# Altium schematic sheet TankBoardSheet1.SchDoc
size A
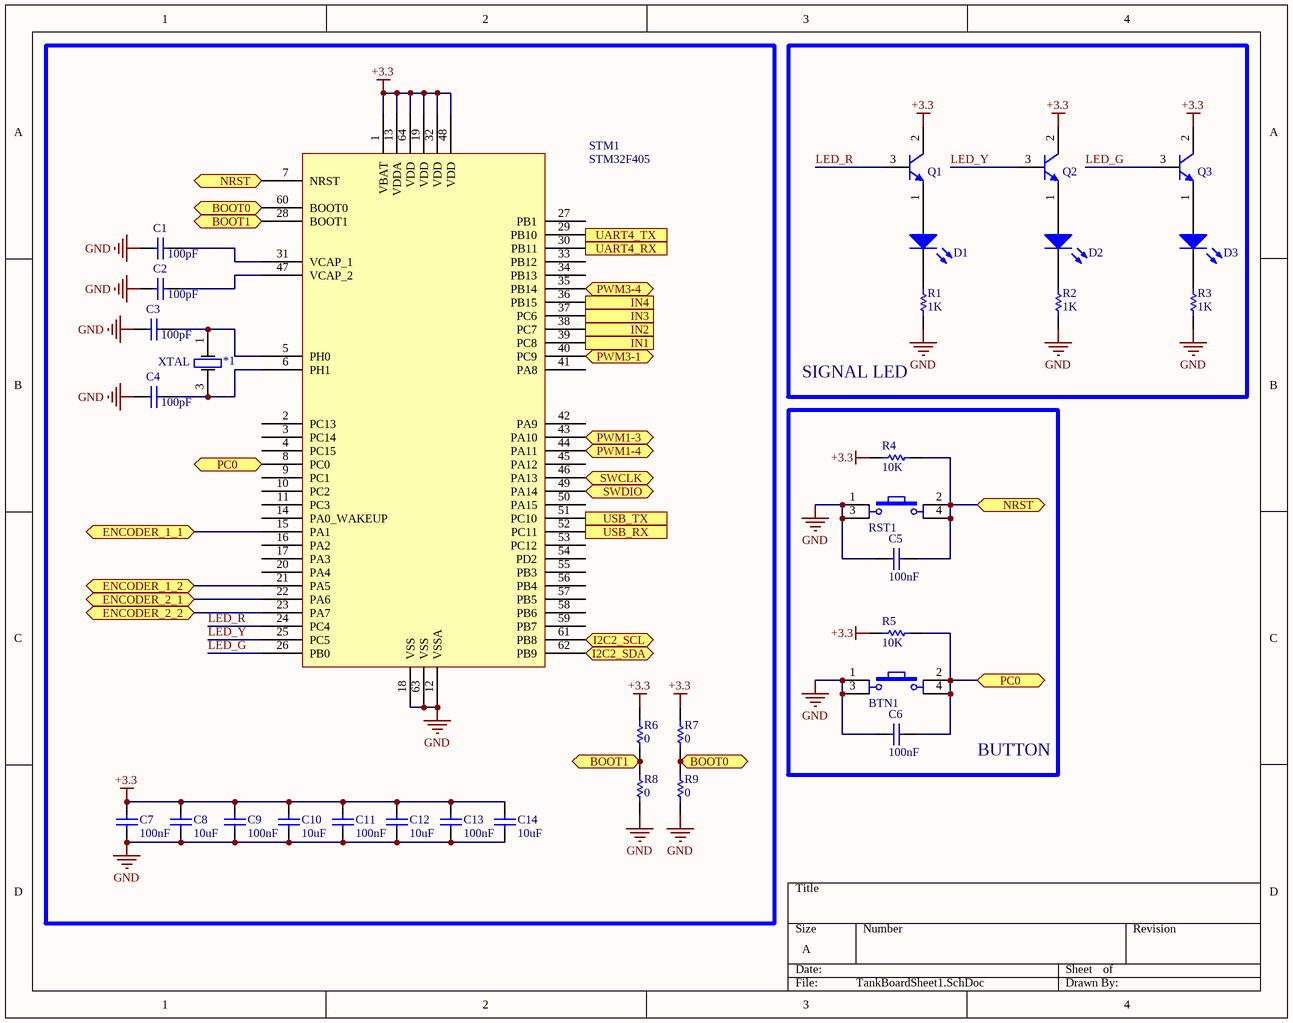
[diagram p0: TankBoardSheet1.SchDoc]

## Parts
*1  XTAL  [XTAL SMD 4PIN]
BTN1  SW  [Tact SW 4 pin]  (value not drawn)
C1  value 100pF  [CAP-SM-0603]  (hidden comment: Cap Non-Pol SMD)
C2  value 100pF  [CAP-SM-0603]  (hidden comment: Cap Non-Pol SMD)
C3  value 100pF  [CAP-SM-0603]  (hidden comment: Cap Non-Pol SMD)
C4  value 100pF  [CAP-SM-0603]  (hidden comment: Cap Non-Pol SMD)
C5  value 100nF  [CAP-SM-0603]  (hidden comment: Cap Non-Pol SMD)
C6  value 100nF  [CAP-SM-0603]  (hidden comment: Cap Non-Pol SMD)
C7  value 100nF  [CAP-SM-0603]  (hidden comment: Cap Non-Pol SMD)
C8  value 10uF  [CAP-SM-0603]  (hidden comment: Cap Non-Pol SMD)
C9  value 100nF  [CAP-SM-0603]  (hidden comment: Cap Non-Pol SMD)
C10  value 10uF  [CAP-SM-0603]  (hidden comment: Cap Non-Pol SMD)
C11  value 100nF  [CAP-SM-0603]  (hidden comment: Cap Non-Pol SMD)
C12  value 10uF  [CAP-SM-0603]  (hidden comment: Cap Non-Pol SMD)
C13  value 100nF  [CAP-SM-0603]  (hidden comment: Cap Non-Pol SMD)
C14  value 10uF  [CAP-SM-0603]  (hidden comment: Cap Non-Pol SMD)
D1  LED SMD  [LED_0603_Blue]  (value not drawn)
D2  LED SMD  [LED_0603_Blue]  (value not drawn)
D3  LED SMD  [LED_0603_Blue]  (value not drawn)
Q1  C1815  [SOT23B]  (value not drawn)
Q2  C1815  [SOT23B]  (value not drawn)
Q3  C1815  [SOT23B]  (value not drawn)
R1  value 1K  [RES-SM-0603]  (hidden comment: RESISTOR SMD)
R2  value 1K  [RES-SM-0603]  (hidden comment: RESISTOR SMD)
R3  value 1K  [RES-SM-0603]  (hidden comment: RESISTOR SMD)
R4  value 10K  [RES-SM-0603]  (hidden comment: RESISTOR SMD)
R5  value 10K  [RES-SM-0603]  (hidden comment: RESISTOR SMD)
R6  value 0  [RES-SM-0603]  (hidden comment: RESISTOR SMD)
R7  value 0  [RES-SM-0603]  (hidden comment: RESISTOR SMD)
R8  value 0  [RES-SM-0603]  (hidden comment: RESISTOR SMD)
R9  value 0  [RES-SM-0603]  (hidden comment: RESISTOR SMD)
RST1  SW  [Tact SW 4 pin]  (value not drawn)
STM1  STM32F405  [CQFP50P1150X1150X160-64N]

## Blocks framed on the sheet
SIGNAL LED: D1-D3 Q1-Q3 R1-R3
BUTTON: BTN1 C5 C6 R4 R5 RST1

## Ports
BOOT0 (bidir), BOOT1 (bidir), ENCODER_1_1 (bidir), ENCODER_1_2 (bidir), ENCODER_2_1 (bidir), ENCODER_2_2 (bidir), I2C2_SCL (bidir), I2C2_SDA (bidir), IN1 (out), IN2 (out), IN3 (out), IN4 (out), NRST (bidir), PC0 (bidir), PWM1-3 (bidir), PWM1-4 (bidir), PWM3-1 (bidir), PWM3-4 (bidir), SWCLK (bidir), SWDIO (bidir), UART4_RX (in), UART4_TX (out), USB_RX (in), USB_TX (out)

## Nets
+3.3: C7.1 C8.1 C9.1 C10.1 C11.1 C12.1 C13.1 C14.1 Q1.2(C) Q2.2(C) Q3.2(C) R4.1 R5.1 R6.2 R7.2 STM1.1(VBAT) STM1.13(VDDA) STM1.19(VDD) STM1.32(VDD) STM1.48(VDD) STM1.64(VDD)
GND: BTN1.1 BTN1.3 C1.1 C2.1 C3.1 C4.1 C5.2 C6.2 C7.2 C8.2 C9.2 C10.2 C11.2 C12.2 C13.2 C14.2 R1.1 R2.1 R3.1 R8.1 R9.1 RST1.1 RST1.3 STM1.12(VSSA) STM1.18(VSS) STM1.63(VSS)
BOOT0: R7.1 R9.2 STM1.60(BOOT0) ; port BOOT0
BOOT1: R6.1 R8.2 STM1.28(BOOT1) ; port BOOT1
ENCODER_1_1: STM1.15(PA1) ; port ENCODER_1_1
ENCODER_1_2: STM1.21(PA5) ; port ENCODER_1_2
ENCODER_2_1: STM1.22(PA6) ; port ENCODER_2_1
ENCODER_2_2: STM1.23(PA7) ; port ENCODER_2_2
I2C2_SCL: STM1.61(PB8) ; port I2C2_SCL
I2C2_SDA: STM1.62(PB9) ; port I2C2_SDA
IN1: STM1.39(PC8) ; port IN1
IN2: STM1.38(PC7) ; port IN2
IN3: STM1.37(PC6) ; port IN3
IN4: STM1.36(PB15) ; port IN4
LED_G: Q3.3(B) STM1.26(PB0)
LED_R: Q1.3(B) STM1.24(PC4)
LED_Y: Q2.3(B) STM1.25(PC5)
NRST: C5.1 R4.2 RST1.2 RST1.4 STM1.7(NRST) ; port NRST
PC0: BTN1.2 BTN1.4 C6.1 R5.2 STM1.8(PC0) ; port PC0
PWM1-3: STM1.43(PA10) ; port PWM1-3
PWM1-4: STM1.44(PA11) ; port PWM1-4
PWM3-1: STM1.40(PC9) ; port PWM3-1
PWM3-4: STM1.35(PB14) ; port PWM3-4
SWCLK: STM1.46(PA13) ; port SWCLK
SWDIO: STM1.49(PA14) ; port SWDIO
UART4_RX: STM1.30(PB11) ; port UART4_RX
UART4_TX: STM1.29(PB10) ; port UART4_TX
USB_RX: STM1.52(PC11) ; port USB_RX
USB_TX: STM1.51(PC10) ; port USB_TX
Net*1_1: *1.1 C3.2 STM1.5(PH0)
Net*1_3: *1.3 C4.2 STM1.6(PH1)
NetC1_2: C1.2 STM1.31(VCAP_1)
NetC2_2: C2.2 STM1.47(VCAP_2)
NetD1_1: D1.1(A) Q1.1(E)
NetD1_2: D1.2(K) R1.2
NetD2_1: D2.1(A) Q2.1(E)
NetD2_2: D2.2(K) R2.2
NetD3_1: D3.1(A) Q3.1(E)
NetD3_2: D3.2(K) R3.2

Not connected (* = marked no-connect by the designer): STM1 2(PC13) 3(PC14) 4(PC15) 9(PC1) 10(PC2) 11(PC3) 14(PA0_WAKEUP) 16(PA2) 17(PA3) 20(PA4) 27(PB1) 33(PB12) 34(PB13) 41(PA8) 42(PA9) 45(PA12) 50(PA15) 53(PC12) 54(PD2) 55(PB3) 56(PB4) 57(PB5) 58(PB6) 59(PB7)

## Library data of the parts
BTN1 RST1 = Tact SW - 4Pin: Switch button 4 pin; Value: Button chip 4 pin
C1-C14 = Cap Non-Pol SMD: Capacitor
D1-D3 = LED SMD: LED
Q1-Q3 = C1815: NPN Bipolar Transistor
R1-R9 = RESISTOR SMD: Resistor